# Altium project Raspi_Hat.PrjPcb
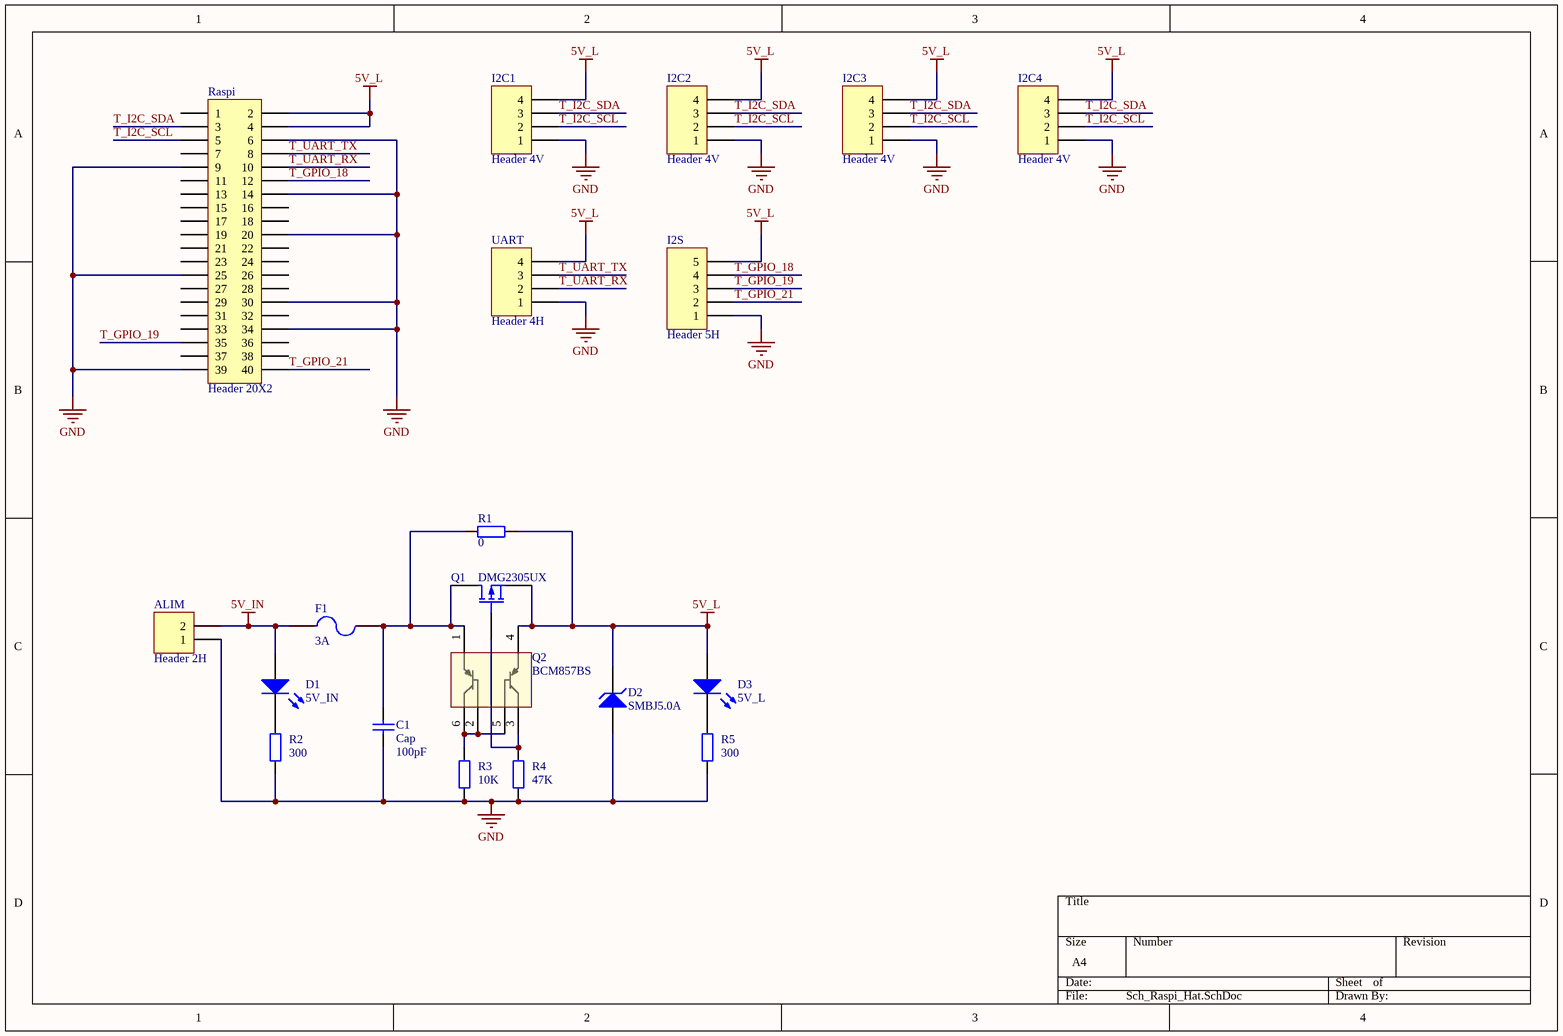
[diagram p0: Sch_Raspi_Hat.SchDoc]
1 sheet, 20 parts. Net scope: global (net labels, ports and power ports of the same name join across sheets).
Board file: PCB_Rapsi_Hat.PcbDoc

## Sheet Sch_Raspi_Hat.SchDoc
size A4

### Parts
ALIM  Header 2H  [Molex_MiniFitJr_2x1H]
C1  Cap  value 100pF  [Capacitor 1206]
D1  5V_IN  [KP-3216SEC]
D2  SMBJ5.0A  [SMB]
D3  5V_L  [KP-3216SEC]
F1  3A  [Resistor 1206]
I2C1  Header 4V  [B4BXHALFSN]
I2C2  Header 4V  [B4BXHALFSN]
I2C3  Header 4V  [B4BXHALFSN]
I2C4  Header 4V  [B4BXHALFSN]
I2S  Header 5H  [S5B-XH-A]
Q1  DMG2305UX  [SOT23_L]
Q2  BCM857BS  [SOT65P210X110-6N]
R1  value 0  [Resistor 1206]  (hidden comment: Res2)
R2  value 300  [Resistor 1206]  (hidden comment: Res2)
R3  value 10K  [Resistor 1206]  (hidden comment: Res2)
R4  value 47K  [Resistor 1206]  (hidden comment: Res2)
R5  value 300  [Resistor 1206]  (hidden comment: Res2)
Raspi  Header 20X2  [HDR2X20]
UART  Header 4H  [S4B-XH-A]

### Nets
5V_IN: ALIM.2 D1.1(A) F1.1
5V_L: D2.2(K) D3.1(A) I2C1.4 I2C2.4 I2C3.4 I2C4.4 I2S.5 Q1.3(S) Q2.4(EMITTER_TR2) R1.1 Raspi.2 Raspi.4 UART.4
GND: ALIM.1 C1.1 D2.1(A) I2C1.1 I2C2.1 I2C3.1 I2C4.1 I2S.1 R2.1 R3.1 R4.1 R5.1 Raspi.6 Raspi.9 Raspi.14 Raspi.20 Raspi.25 Raspi.30 Raspi.34 Raspi.39 UART.1
T_GPIO_18: I2S.4 Raspi.12
T_GPIO_19: I2S.3 Raspi.35
T_GPIO_21: I2S.2 Raspi.40
T_I2C_SCL: I2C1.2 I2C2.2 I2C3.2 I2C4.2 Raspi.5
T_I2C_SDA: I2C1.3 I2C2.3 I2C3.3 I2C4.3 Raspi.3
T_UART_RX: Raspi.10 UART.2
T_UART_TX: Raspi.8 UART.3
NetC1_2: C1.2 F1.2 Q1.1(D) Q2.1(EMITTER_TR1) R1.2
NetD1_2: D1.2(K) R2.2
NetD3_2: D3.2(K) R5.2
NetQ1_2: Q1.2(G) Q2.3(COLLECTOR_TR2) R4.2
NetQ2_2: Q2.2(BASE_TR1) Q2.5(BASE_TR2) Q2.6(COLLECTOR_TR1) R3.2

Not connected (* = marked no-connect by the designer): Raspi 1 7 11 13 15 16 17 18 19 21 22 23 24 26 27 28 29 31 32 33 36 37 38

### Library data of the parts
ALIM = Header 2H: Header, 2-Pin, Right Angle; LatestRevisionDate: 17-Jul-2002; LatestRevisionNote: Re-released for DXP Platform.; Publisher: Altium Limited
C1 = Cap: Capacitor; Published: 8-Jun-2000; LatestRevisionDate: 17-Jul-2002; LatestRevisionNote: Re-released for DXP Platform.; PackageReference: RAD-0.3; Publisher: Altium Limited; PackageDescription: Radial Cap, Thru-Hole; 2 Leads; 0.3 in Pin Spacing
D1 D3 = LED2: Typical RED, GREEN, YELLOW, AMBER GaAs LED; Published: 8-Jun-2000; LatestRevisionDate: 17-Jul-2002; LatestRevisionNote: Re-released for DXP Platform.; PackageVersion: Feb-2002; PackageReference: 3.2X1.6X1.1; Publisher: Altium Limited; PackageDescription: SM LED; 2 Flat Leads
D2 = D Zener: Zener Diode; Published: 8-Jun-2000; LatestRevisionDate: 17-Jul-2002; LatestRevisionNote: Re-released for DXP Platform.; PackageReference: DIODE-0.7; Publisher: Altium Limited; PackageDescription: Diode, Thru-Hole; 2 Leads; 0.7 in Pin Spacing
F1 = Fuse 2: Fuse; Published: 8-Jun-2000; LatestRevisionDate: 17-Jul-2002; LatestRevisionNote: Re-released for DXP Platform.; PackageReference: PIN-W2/E2.8; Publisher: Altium Limited; PackageDescription: Thru-Hole; 2 Leads
I2C1-I2C4 UART = Header 4H: Header, 4-Pin, Right Angle; LatestRevisionDate: 17-Jul-2002; LatestRevisionNote: Re-released for DXP Platform.; Publisher: Altium Limited
I2S = Header 5H: Header, 5-Pin, Right Angle; LatestRevisionDate: 17-Jul-2002; LatestRevisionNote: Re-released for DXP Platform.; Publisher: Altium Limited
Q1 = MOSFET-P: P-Channel MOSFET; Published: 8-Jun-2000; LatestRevisionDate: 17-Jul-2002; LatestRevisionNote: Re-released for DXP Platform.; PackageVersion: 1995/1996; PackageReference: E3; Publisher: Altium Limited; PackageDescription: TO, Flat Index; 3 In-Line, Axial Leads; Body Dia. 4.6mm; Lead Dia. 0.5 mm (max)
Q2 = BCM857BS: Transistor; Manufacturer_Name: Nexperia; Datasheet Link: https://assets.nexperia.com/documents/data-sheet/BCM857BV_BS_DS.pdf; Height: 1.1mm; Manufacturer_Part_Number: BCM857BS; Mouser Part Number: N/A; Mouser Price/Stock: https://www.mouser.com/Search/Refine.aspx?Keyword=N%2FA
R1-R5 = Res2: Resistor; Published: 8-Jun-2000; LatestRevisionDate: 17-Jul-2002; LatestRevisionNote: Re-released for DXP Platform.; PackageReference: AXIAL-0.4; Publisher: Altium Limited; PackageDescription: Axial Device, Thru-Hole; 2 Leads; 0.4 in Pin Spacing
Raspi = Header 20X2: Header, 20-Pin, Dual row; LatestRevisionDate: 17-Jul-2002; LatestRevisionNote: Re-released for DXP Platform.; Publisher: Altium Limited